# Altium schematic sheet PIC32ETH_Ethernet.SchDoc: Ethernet
size A3; SheetNumber: 3
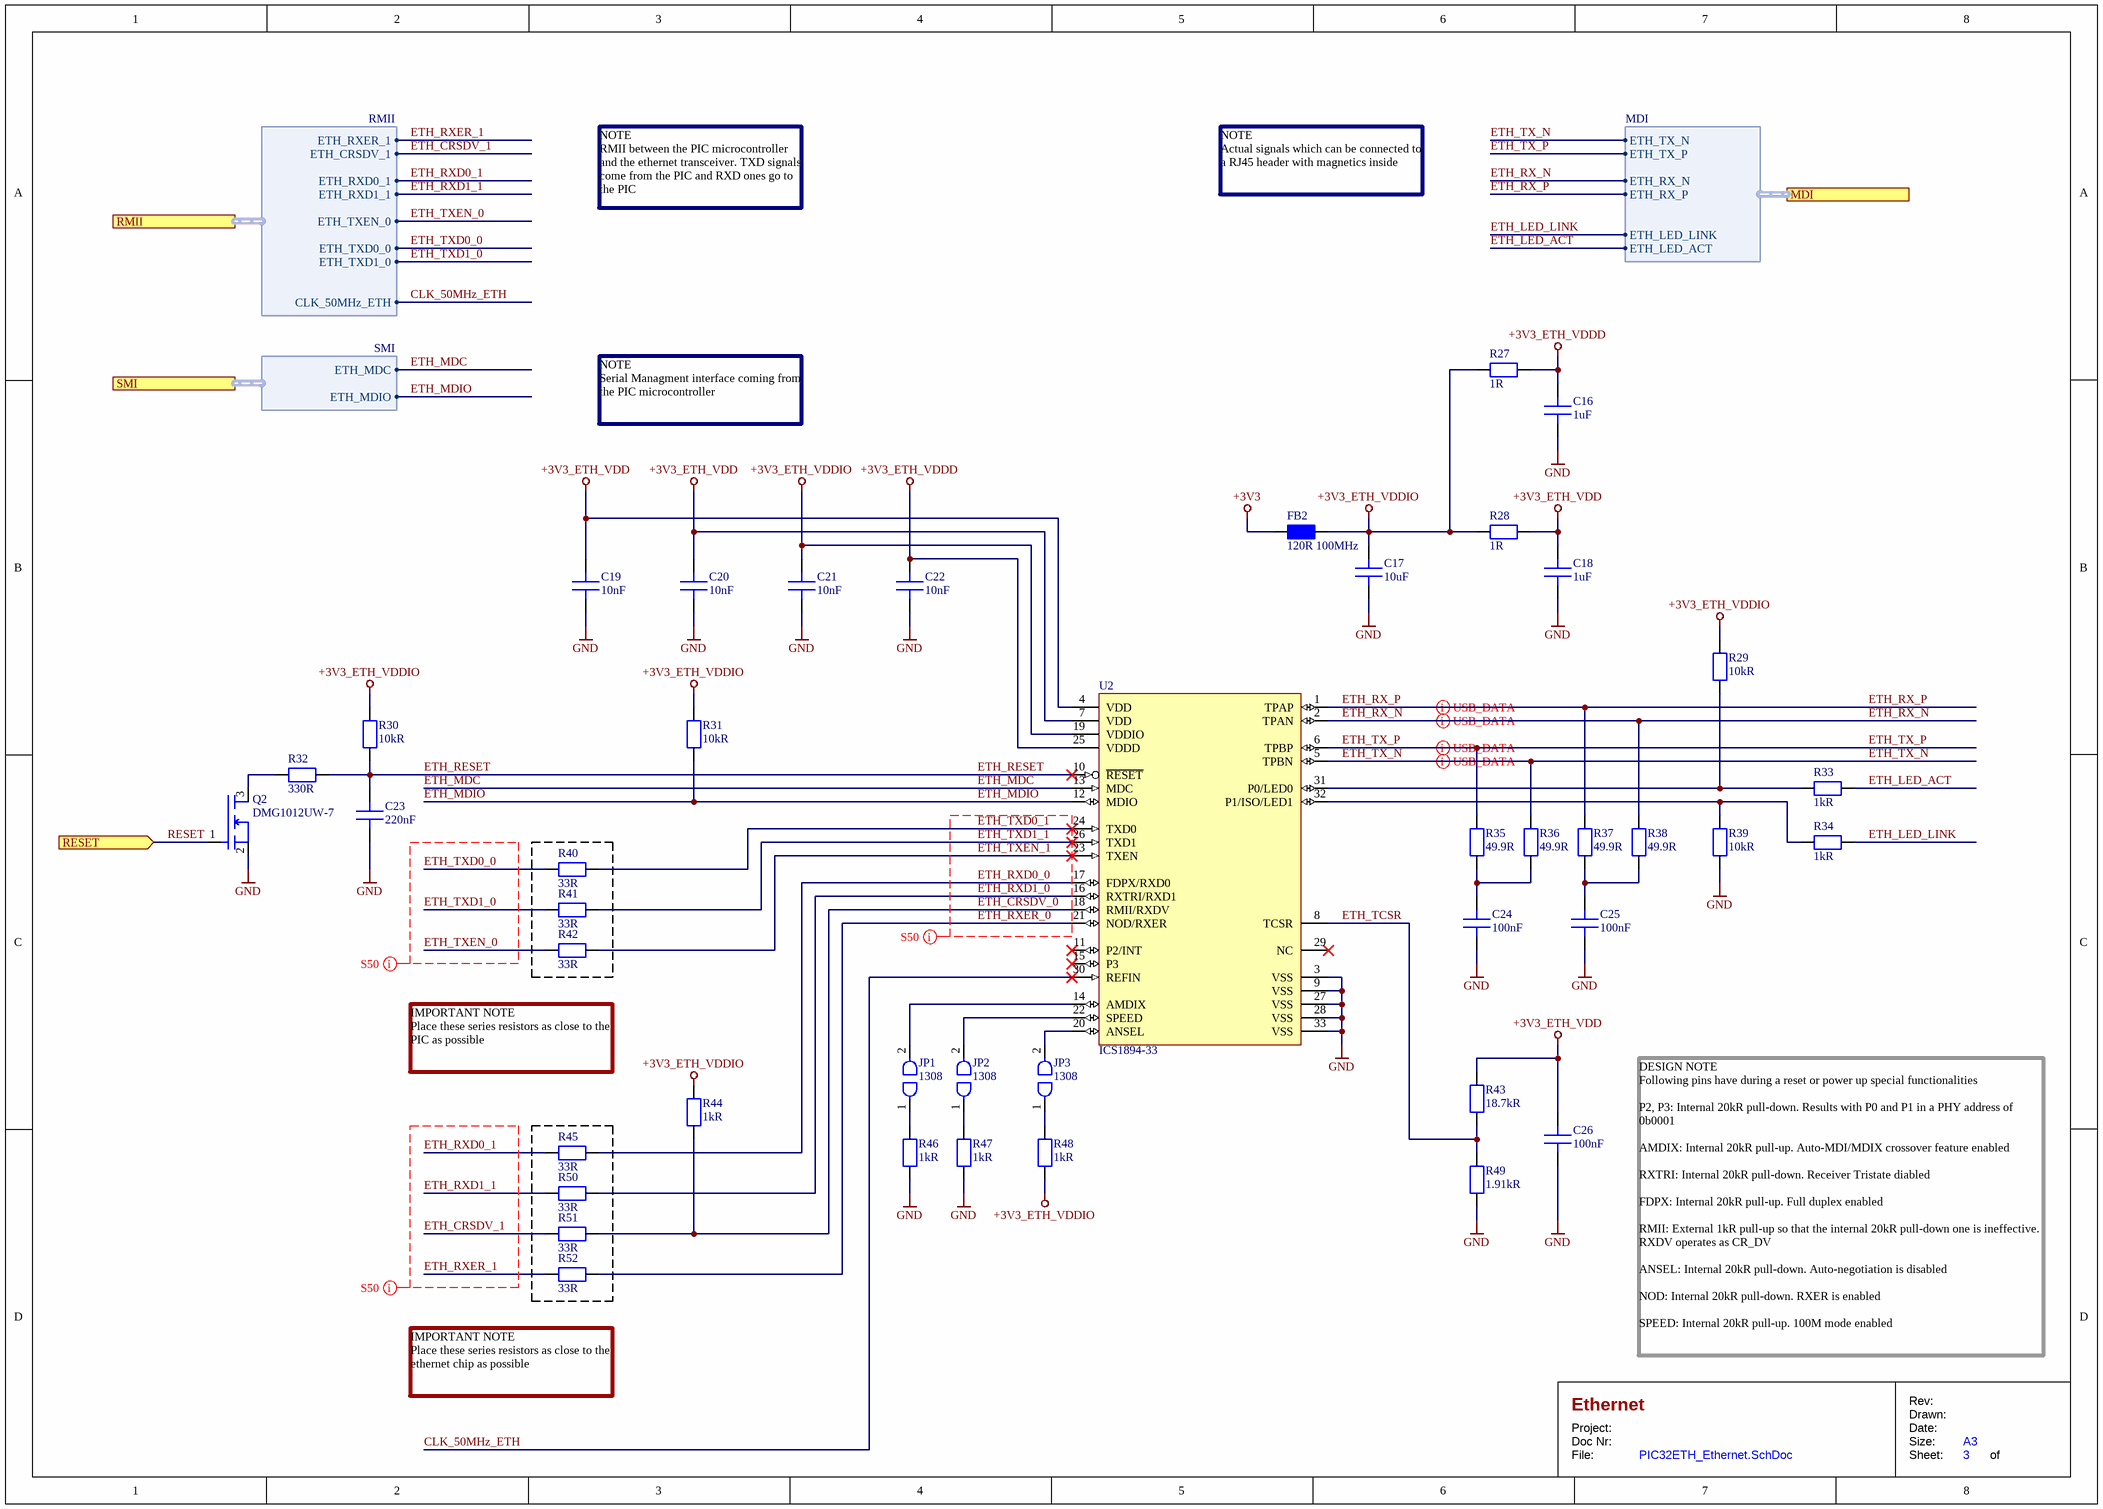
[diagram p0: PIC32ETH_Ethernet.SchDoc]

## Parts
C16  1uF  [C_CHIP2012N]
C17  10uF  [C_CHIP3216N]
C18  1uF  [C_CHIP2012N]
C19  10nF  [C_CHIP2012N]
C20  10nF  [C_CHIP2012N]
C21  10nF  [C_CHIP2012N]
C22  10nF  [C_CHIP2012N]
C23  220nF  [C_CHIP2012N]
C24  100nF  [C_CHIP2012N]
C25  100nF  [C_CHIP2012N]
C26  100nF  [C_CHIP2012N]
FB2  120R 100MHz  [FB_CHIP3216N]
JP1  1308  [JP_SOLDER-2POS-1308]  (no BOM)
JP2  1308  [JP_SOLDER-2POS-1308]  (no BOM)
JP3  1308  [JP_SOLDER-2POS-1308]  (no BOM)
Q2  DMG1012UW-7  [Q_SOT65P210X100-3N]
R27  1R  [R_CHIP2012N]
R28  1R  [R_CHIP2012N]
R29  10kR  [R_CHIP2012N]
R30  10kR  [R_CHIP2012N]
R31  10kR  [R_CHIP2012N]
R32  330R  [R_CHIP2012N]
R33  1kR  [R_CHIP2012N]
R34  1kR  [R_CHIP2012N]
R35  49.9R  [R_CHIP2012N]
R36  49.9R  [R_CHIP2012N]
R37  49.9R  [R_CHIP2012N]
R38  49.9R  [R_CHIP2012N]
R39  10kR  [R_CHIP2012N]
R40  33R  [R_CHIP2012N]
R41  33R  [R_CHIP2012N]
R42  33R  [R_CHIP2012N]
R43  18.7kR  [R_CHIP2012N]
R44  1kR  [R_CHIP2012N]
R45  33R  [R_CHIP2012N]
R46  1kR  [R_CHIP2012N]
R47  1kR  [R_CHIP2012N]
R48  1kR  [R_CHIP2012N]
R49  1.91kR  [R_CHIP2012N]
R50  33R  [R_CHIP2012N]
R51  33R  [R_CHIP2012N]
R52  33R  [R_CHIP2012N]
U2  ICS1894-33  [U_QFN50P500X500X100-HS-33N]

## Ports
MDI (harness MDI), RESET (in), RMII (harness RMII), SMI (harness SMI)

## Harnesses
RMII: CLK_50MHz_ETH, ETH_RXER_1, ETH_TXEN_0, ETH_CRSDV_1, ETH_RXD0_1, ETH_RXD1_1, ETH_TXD1_0, ETH_TXD0_0
MDI: ETH_TX_N, ETH_TX_P, ETH_RX_N, ETH_RX_P, ETH_LED_LINK, ETH_LED_ACT
SMI: ETH_MDIO, ETH_MDC

## Nets
+3V3: FB2.1
+3V3_ETH_VDD: C18.1 C19.2 C20.2 C26.1 R28.2 R43.2 U2.4(VDD) U2.7(VDD)
+3V3_ETH_VDDD: C16.1 C22.2 R27.2 U2.25(VDDD)
+3V3_ETH_VDDIO: C17.2 C21.2 FB2.2 R27.1 R28.1 R29.1 R30.2 R31.2 R44.2 R48.1 U2.19(VDDIO)
GND: C16.2 C17.1 C18.2 C19.1 C20.1 C21.1 C22.1 C23.1 C24.2 C25.2 C26.2 Q2.2(S) R39.1 R46.1 R47.1 R49.1 U2.3(VSS) U2.9(VSS) U2.27(VSS) U2.28(VSS) U2.33(VSS)
CLK_50MHz_ETH: U2.30(REFIN) ; port RMII.CLK_50MHz_ETH
ETH_CRSDV_0: R44.1 R51.2 U2.18(RMII/RXDV)
ETH_CRSDV_1: R51.1 ; port RMII.ETH_CRSDV_1
ETH_LED_ACT: R33.1 ; port MDI.ETH_LED_ACT
ETH_LED_LINK: R34.1 ; port MDI.ETH_LED_LINK
ETH_MDC: U2.13(MDC) ; port SMI.ETH_MDC
ETH_MDIO: R31.1 U2.12(MDIO) ; port SMI.ETH_MDIO
ETH_RESET: C23.2 R30.1 R32.2 U2.10(~{RESET})
ETH_RX_N: R38.2 U2.2(TPAN) ; port MDI.ETH_RX_N
ETH_RX_P: R37.2 U2.1(TPAP) ; port MDI.ETH_RX_P
ETH_RXD0_0: R45.2 U2.17(FDPX/RXD0)
ETH_RXD0_1: R45.1 ; port RMII.ETH_RXD0_1
ETH_RXD1_0: R50.2 U2.16(RXTRI/RXD1)
ETH_RXD1_1: R50.1 ; port RMII.ETH_RXD1_1
ETH_RXER_0: R52.2 U2.21(NOD/RXER)
ETH_RXER_1: R52.1 ; port RMII.ETH_RXER_1
ETH_TCSR: R43.1 R49.2 U2.8(TCSR)
ETH_TX_N: R36.2 U2.5(TPBN) ; port MDI.ETH_TX_N
ETH_TX_P: R35.2 U2.6(TPBP) ; port MDI.ETH_TX_P
ETH_TXD0_0: R40.1 ; port RMII.ETH_TXD0_0
ETH_TXD0_1: R40.2 U2.24(TXD0)
ETH_TXD1_0: R41.1 ; port RMII.ETH_TXD1_0
ETH_TXD1_1: R41.2 U2.26(TXD1)
ETH_TXEN_0: R42.1 ; port RMII.ETH_TXEN_0
ETH_TXEN_1: R42.2 U2.23(TXEN)
RESET: Q2.1(G) ; port RESET
NetC24_1: C24.1 R35.1 R36.1
NetC25_1: C25.1 R37.1 R38.1
NetJP1_1: JP1.1 R46.2
NetJP1_2: JP1.2 U2.14(AMDIX)
NetJP2_1: JP2.1 R47.2
NetJP2_2: JP2.2 U2.22(SPEED)
NetJP3_1: JP3.1 R48.2
NetJP3_2: JP3.2 U2.20(ANSEL)
NetQ2_3: Q2.3(D) R32.1
NetR29_2: R29.2 R33.2 U2.31(P0/LED0)
NetR34_2: R34.2 R39.2 U2.32(P1/ISO/LED1)

Not connected (* = marked no-connect by the designer): U2 11(P2/INT)* 15(P3)* 29(NC)*

## Layout directives
differential pair; differential pair class ETH_TX: ETH_TX_N, ETH_TX_P
differential pair; differential pair class ETH_RX: ETH_RX_N, ETH_RX_P
net class IMPEDANCE_S50: ETH_CRSDV_0, ETH_CRSDV_1, ETH_RXD0_0, ETH_RXD0_1, ETH_RXD1_0, ETH_RXD1_1, ETH_RXER_0, ETH_RXER_1, ETH_TXD0_0, ETH_TXD0_1, ETH_TXD1_0, ETH_TXD1_1, ETH_TXEN_0, ETH_TXEN_1

## Notes on the sheet
- NOTE
  RMII between the PIC microcontroller and the ethernet transceiver. TXD signals come from the PIC and RXD ones go to the PIC
- NOTE
  Actual signals which can be connected to a RJ45 header with magnetics inside
- NOTE
  Serial Managment interface coming from the PIC microcontroller
- IMPORTANT NOTE
  Place these series resistors as close to the PIC as possible
- IMPORTANT NOTE
  Place these series resistors as close to the ethernet chip as possible
- DESIGN NOTE
  Following pins have during a reset or power up special functionalities
  P2, P3: Internal 20kR pull-down. Results with P0 and P1 in a PHY address of 0b0001
  AMDIX: Internal 20kR pull-up. Auto-MDI/MDIX crossover feature enabled
  RXTRI: Internal 20kR pull-down. Receiver Tristate diabled
  FDPX: Internal 20kR pull-up. Full duplex enabled
  RMII: External 1kR pull-up so that the internal 20kR pull-down one is ineffective. RXDV operates as CR_DV
  ANSEL: Internal 20kR pull-down. Auto-negotiation is disabled
  NOD: Internal 20kR pull-down. RXER is enabled
  SPEED: Internal 20kR pull-up. 100M mode enabled
- Project:
- Doc Nr:
- File:
- Drawn:
- Rev:
- Date:
- Size:
- Sheet:
- A3
- of

## Library data of the parts
C16 C18 = C_C0805C105K5RACTU: C CERAMIC 1uF 50V 10% 2012; Manufacturer: Kemet; Dielectric: X7R; Tolerance: +/-10%; Datasheet Url: https://content.kemet.com/datasheets/KEM_C1002_X7R_SMD.pdf; Mounting: SMT; Package: 2012; Part Number: C0805C105K5RACTU; Price: 0.32; Price Currency: CHF; Supplier 1: Digi-Key; Capacitance: 1uF; Voltage: 50V; Supplier Part Number 1: 399-7409-1-ND; Esr: n/a; Pin Count: 2; Temperature Range: -55degC to 125degC
C17 = C_C1206C106K3RACTU: C CERAMIC 10uF 25V 10% 3216; Manufacturer: Kemet; Dielectric: X7R; Tolerance: +/-10%; Package: 3216; Supplier 1: Digi-Key; Part Number: C1206C106K3RACTU; Temperature Range: -55degC to 125degC; Datasheet Url: https://content.kemet.com/datasheets/KEM_C1002_X7R_SMD.pdf; Mounting: SMT; Price: 0.62; Price Currency: CHF; Note: *; Capacitance: 10uF; Voltage: 25V; Pin Count: 2; Esr: n/a; Supplier Part Number 1: 399-7442-1-ND
C19-C22 = C_C0805C103K5RACTU: C CERAMIC 10nF 50V 10% 2012; Manufacturer: Kemet; Dielectric: X7R; Tolerance: +/-10%; Datasheet Url: https://content.kemet.com/datasheets/KEM_C1002_X7R_SMD.pdf; Mounting: SMT; Package: 2012; Part Number: C0805C103K5RACTU; Price: 0.18; Price Currency: CHF; Supplier 1: Digi-Key; Capacitance: 10nF; Voltage: 50V; Supplier Part Number 1: 399-1158-1-ND; Esr: n/a; Pin Count: 2; Temperature Range: -55degC to 125degC
C23 = C_C0805C224K5RACTU: C CERAMIC 220nF 50V 10% 2012; Manufacturer: Kemet; Dielectric: X7R; Tolerance: +/-10%; Datasheet Url: https://content.kemet.com/datasheets/KEM_C1002_X7R_SMD.pdf; Mounting: SMT; Package: 2012; Part Number: C0805C224K5RACTU; Price: 0.16; Price Currency: CHF; Supplier 1: Digi-Key; Capacitance: 220nF; Voltage: 50V; Supplier Part Number 1: 399-3491-1-ND; Esr: n/a; Pin Count: 2; Temperature Range: -55degC to 125degC
C24-C26 = C_C0805C104K5RACTU: C CERAMIC 100nF 50V 10% 2012; Manufacturer: Kemet; Dielectric: X7R; Tolerance: +/-10%; Datasheet Url: https://content.kemet.com/datasheets/KEM_C1002_X7R_SMD.pdf; Mounting: SMT; Package: 2012; Part Number: C0805C104K5RACTU; Price: 0.23; Price Currency: CHF; Supplier 1: Digi-Key; Capacitance: 100nF; Voltage: 50V; Supplier Part Number 1: 399-1170-1-ND; Esr: n/a; Pin Count: 2; Temperature Range: -55degC to 125degC
FB2 = FB_BLM31KN121SN1L: FB 120R 100MHz 6A 3216; Manufacturer: Murata Electronics; Resistance: 9mR; Datasheet Url: https://www.murata.com/en-us/products/productdata/8801529331742/ENFA0091.pdf; Mounting: SMT; Package: 3216; Part Number: BLM31KN121SN1L; Price: 0.29; Price Currency: CHF; Supplier 1: Digi-Key; Supplier Part Number 1: 490-16524-1-ND; Temperature Range: -55degC to 125degC; Pin Count: 2; Current: 6A; Impedance: 120R 100MHz
JP1-JP3 = JP_SOLDER-2POS-1308: JP SOLDER 2POS 1308; Datasheet Url: n/a; Manufacturer: n/a; Mounting: SMT; Package: 1308; Part Number: n/a; Price: n/a; Price Currency: n/a; Supplier 1: n/a; Supplier Part Number 1: n/a; Temperature Range: n/a; Pin Count: 2
Q2 = Q_DMG1012UW-7: Q MOSFET N-CH 20V 1A SOT-323; Manufacturer: Diodes Incorporated; Power: 290mW; Voltage Gate Source: +/-6V; Datasheet Url: https://www.diodes.com/assets/Datasheets/ds31859.pdf; Mounting: SMT; Package: SOT-323; Part Number: DMG1012UW-7; Price: 0.39; Price Currency: CHF; Supplier 1: Digi-Key; Supplier Part Number 1: DMG1012UW-7DICT-ND; Current Drain: 1A; Pin Count: 3; Temperature Range: -55degC to 150degC; Voltage Drain Source: 20V; Mosfet Type: N-CH
R27 R28 = R_RMCF0805FT1R00: R SMT 1R 1% 125mW 2012; Manufacturer: Stackpole Electronics Inc; Temperature Coefficient: 100ppm/degC; Tolerance: +/-1%; Voltage: 150V; Datasheet Url: https://www.seielect.com/catalog/sei-rmcf_rmcp.pdf; Mounting: SMT; Package: 2012; Part Number: RMCF0805FT1R00; Price: 0.10; Price Currency: CHF; Supplier 1: Digi-Key; Resistance: 1R; Supplier Part Number 1: RMCF0805FT1R00CT-ND; Temperature Range: -55degC to 155degC; Pin Count: 2; Power: 125mW
R29-R31 R39 = R_RMCF0805FT10K0: R SMT 10kR 1% 125mW 2012; Manufacturer: Stackpole Electronics Inc; Temperature Coefficient: 100ppm/degC; Tolerance: +/-1%; Voltage: 150V; Datasheet Url: https://www.seielect.com/catalog/sei-rmcf_rmcp.pdf; Mounting: SMT; Package: 2012; Part Number: RMCF0805FT10K0; Price: 0.10; Price Currency: CHF; Supplier 1: Digi-Key; Resistance: 10kR; Power: 125mW; Supplier Part Number 1: RMCF0805FT10K0CT-ND; Pin Count: 2; Temperature Range: -55degC to 155degC
R32 = R_RMCF0805FT330R: R SMT 330R 1% 125mW 2012; Manufacturer: Stackpole Electronics Inc; Temperature Coefficient: 100ppm/degC; Tolerance: +/-1%; Voltage: 150V; Datasheet Url: https://www.seielect.com/catalog/sei-rmcf_rmcp.pdf; Mounting: SMT; Package: 2012; Part Number: RMCF0805FT330R; Price: 0.10; Price Currency: CHF; Supplier 1: Digi-Key; Resistance: 330R; Supplier Part Number 1: RMCF0805FT330RCT-ND; Temperature Range: -55degC to 155degC; Pin Count: 2; Power: 125mW
R33 R34 R44 R46-R48 = R_RMCF0805FT1K00: R SMT 1kR 1% 125mW 2012; Manufacturer: Stackpole Electronics Inc; Temperature Coefficient: 100ppm/degC; Tolerance: +/-1%; Voltage: 150V; Datasheet Url: https://www.seielect.com/catalog/sei-rmcf_rmcp.pdf; Mounting: SMT; Package: 2012; Part Number: RMCF0805FT1K00; Price: 0.10; Price Currency: CHF; Supplier 1: Digi-Key; Resistance: 1kR; Supplier Part Number 1: RMCF0805FT1K00CT-ND; Temperature Range: -55degC to 155degC; Pin Count: 2; Power: 125mW
R35-R38 = R_RMCF0805FT49R9: R SMT 49.9R 1% 125mW 2012; Manufacturer: Stackpole Electronics Inc; Temperature Coefficient: 100ppm/degC; Tolerance: +/-1%; Voltage: 150V; Datasheet Url: https://www.seielect.com/catalog/sei-rmcf_rmcp.pdf; Mounting: SMT; Package: 2012; Part Number: RMCF0805FT49R9; Price: 0.10; Price Currency: CHF; Supplier 1: Digi-Key; Resistance: 49.9R; Supplier Part Number 1: RMCF0805FT49R9CT-ND; Temperature Range: -55degC to 155degC; Pin Count: 2; Power: 125mW
R40-R42 R45 R50-R52 = R_RMCF0805FT33R0: R SMT 33R 1% 125mW 2012; Manufacturer: Stackpole Electronics Inc; Temperature Coefficient: 100ppm/degC; Tolerance: +/-1%; Voltage: 150V; Datasheet Url: https://www.seielect.com/catalog/sei-rmcf_rmcp.pdf; Mounting: SMT; Package: 2012; Part Number: RMCF0805FT33R0; Price: 0.10; Price Currency: CHF; Supplier 1: Digi-Key; Resistance: 33R; Supplier Part Number 1: RMCF0805FT33R0CT-ND; Temperature Range: -55degC to 155degC; Pin Count: 2; Power: 125mW
R43 = R_RMCF0805FT18K7: R SMT 18.7kR 1% 125mW 2012; Manufacturer: Stackpole Electronics Inc; Temperature Coefficient: 100ppm/degC; Tolerance: +/-1%; Voltage: 150V; Datasheet Url: https://www.seielect.com/catalog/sei-rmcf_rmcp.pdf; Mounting: SMT; Package: 2012; Part Number: RMCF0805FT18K7; Price: 0.10; Price Currency: CHF; Supplier 1: Digi-Key; Resistance: 18.7kR; Power: 125mW; Supplier Part Number 1: RMCF0805FT18K7CT-ND; Pin Count: 2; Temperature Range: -55degC to 155degC
R49 = R_RMCF0805FT1K91: R SMT 1.91kR 1% 125mW 2012; Manufacturer: Stackpole Electronics Inc; Temperature Coefficient: 100ppm/degC; Tolerance: +/-1%; Voltage: 150V; Datasheet Url: https://www.seielect.com/catalog/sei-rmcf_rmcp.pdf; Mounting: SMT; Package: 2012; Part Number: RMCF0805FT1K91; Price: 0.10; Price Currency: CHF; Supplier 1: Digi-Key; Resistance: 1.91kR; Power: 125mW; Supplier Part Number 1: 738-RMCF0805FT1K91CT-ND; Pin Count: 2; Temperature Range: -55degC to 155degC
U2 = U_ICS1894-33: U TRANSCEIVER RMII-ETHERNET 32-QFN; Manufacturer: Renesas; Voltage Input: 3.3V; Datasheet Url: https://www.mouser.ch/datasheet/2/698/REN_1894_33_DST_20120301-1711194.pdf; Mounting: SMT; Package: 32-QFN; Part Number: ICS1894-33; Price: 4.81; Price Currency: CHF; Supplier 1: Mouser; Supplier Part Number 1: 972-1894K-33LF; Temperature Range: 0degC to 70degC; Pin Count: 33; Transceiver Type: RMII-Ethernet